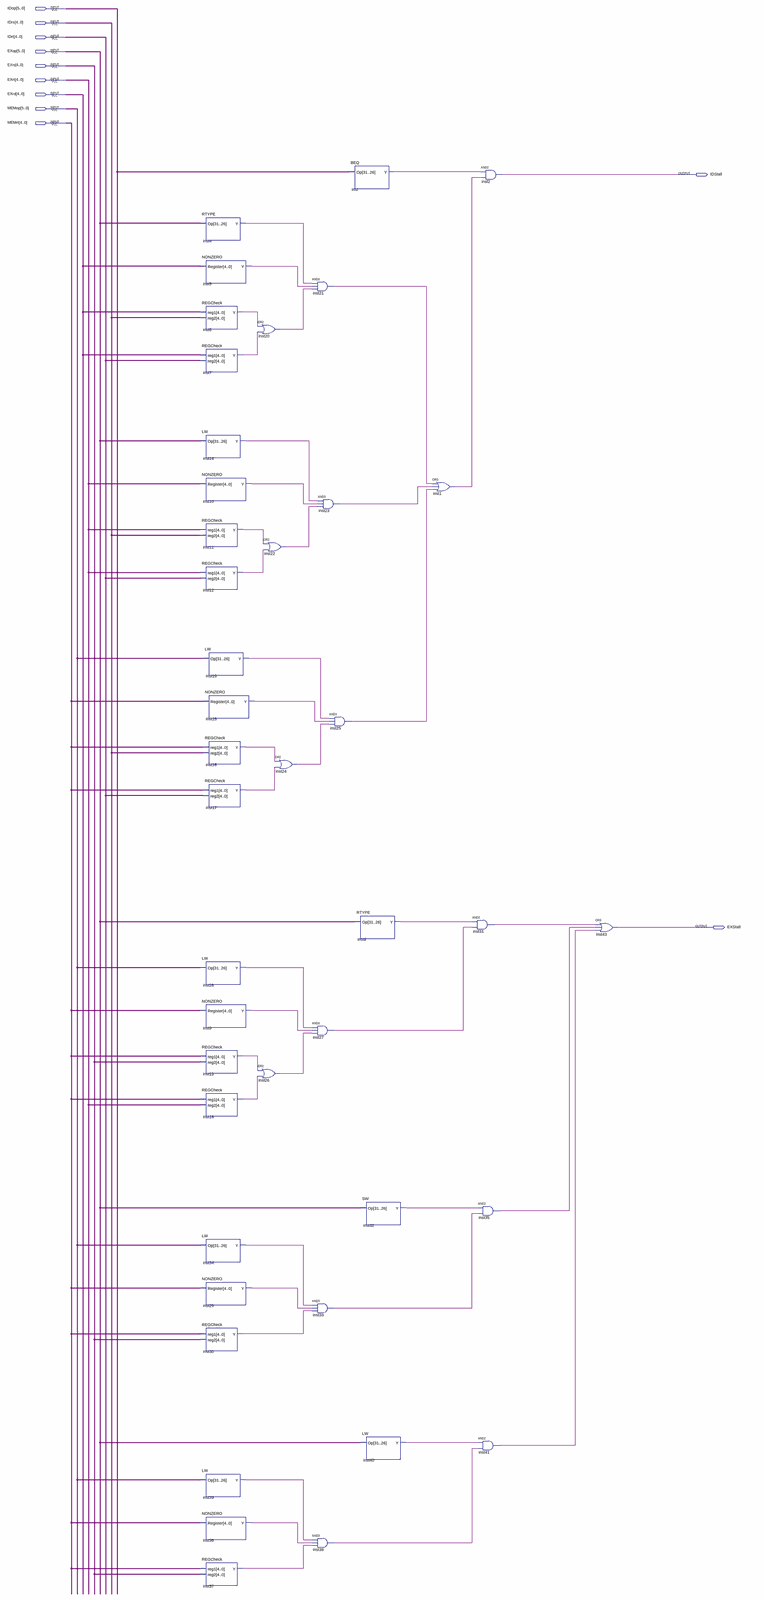
[diagram p0: schematic sheet, whole]
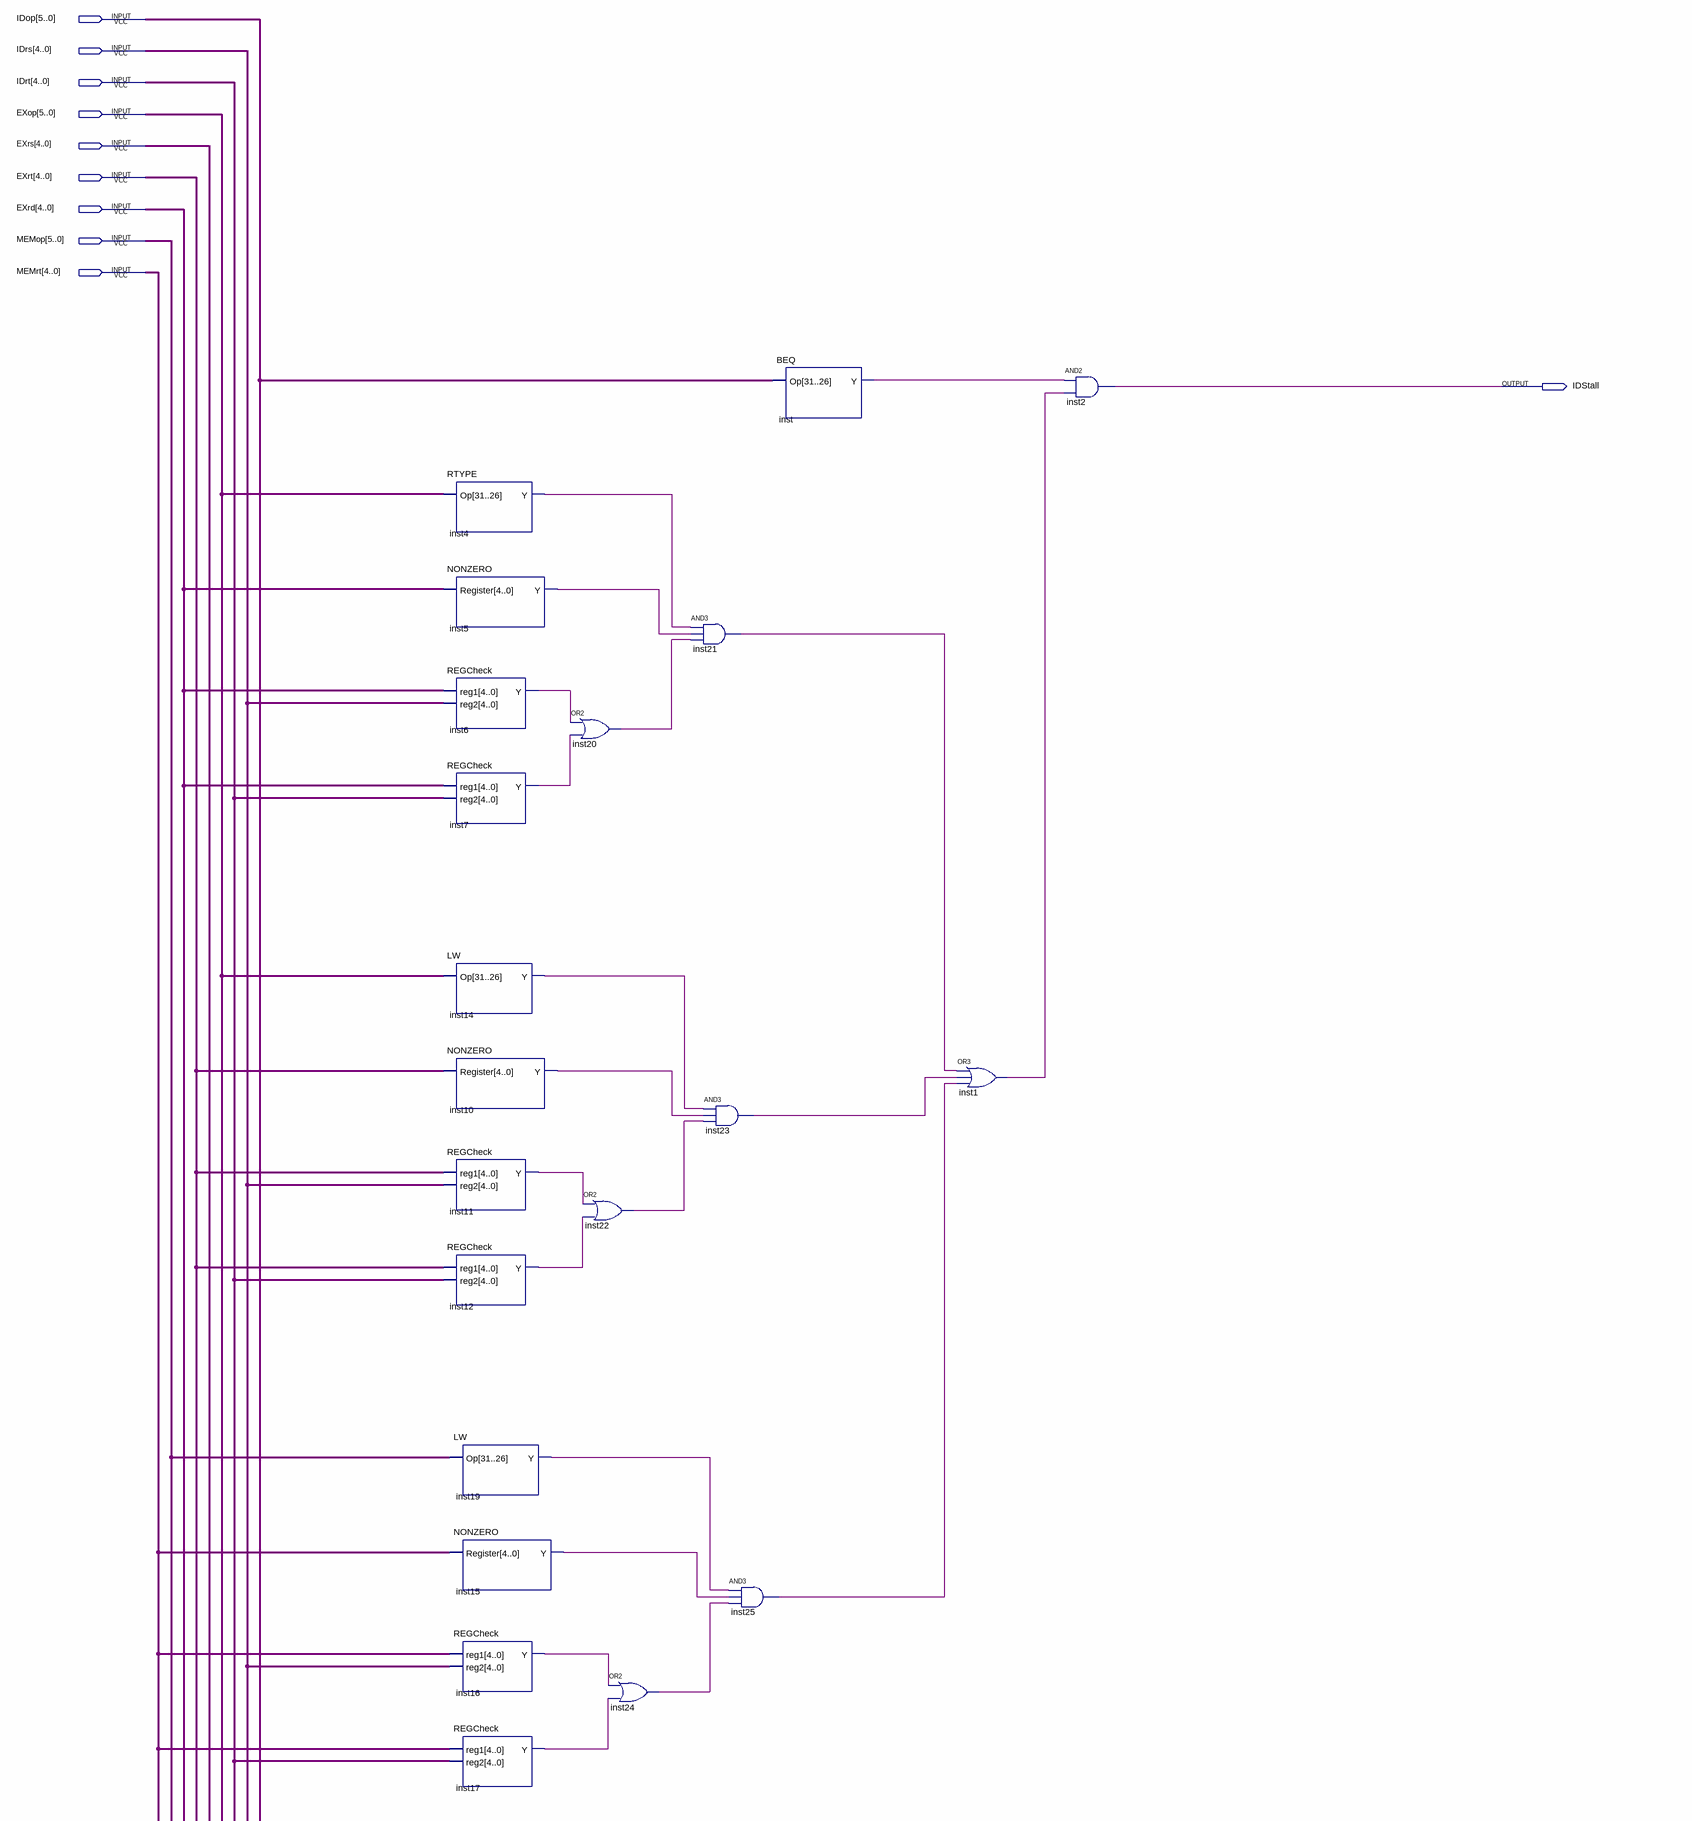
[diagram p1: schematic sheet, upper part]
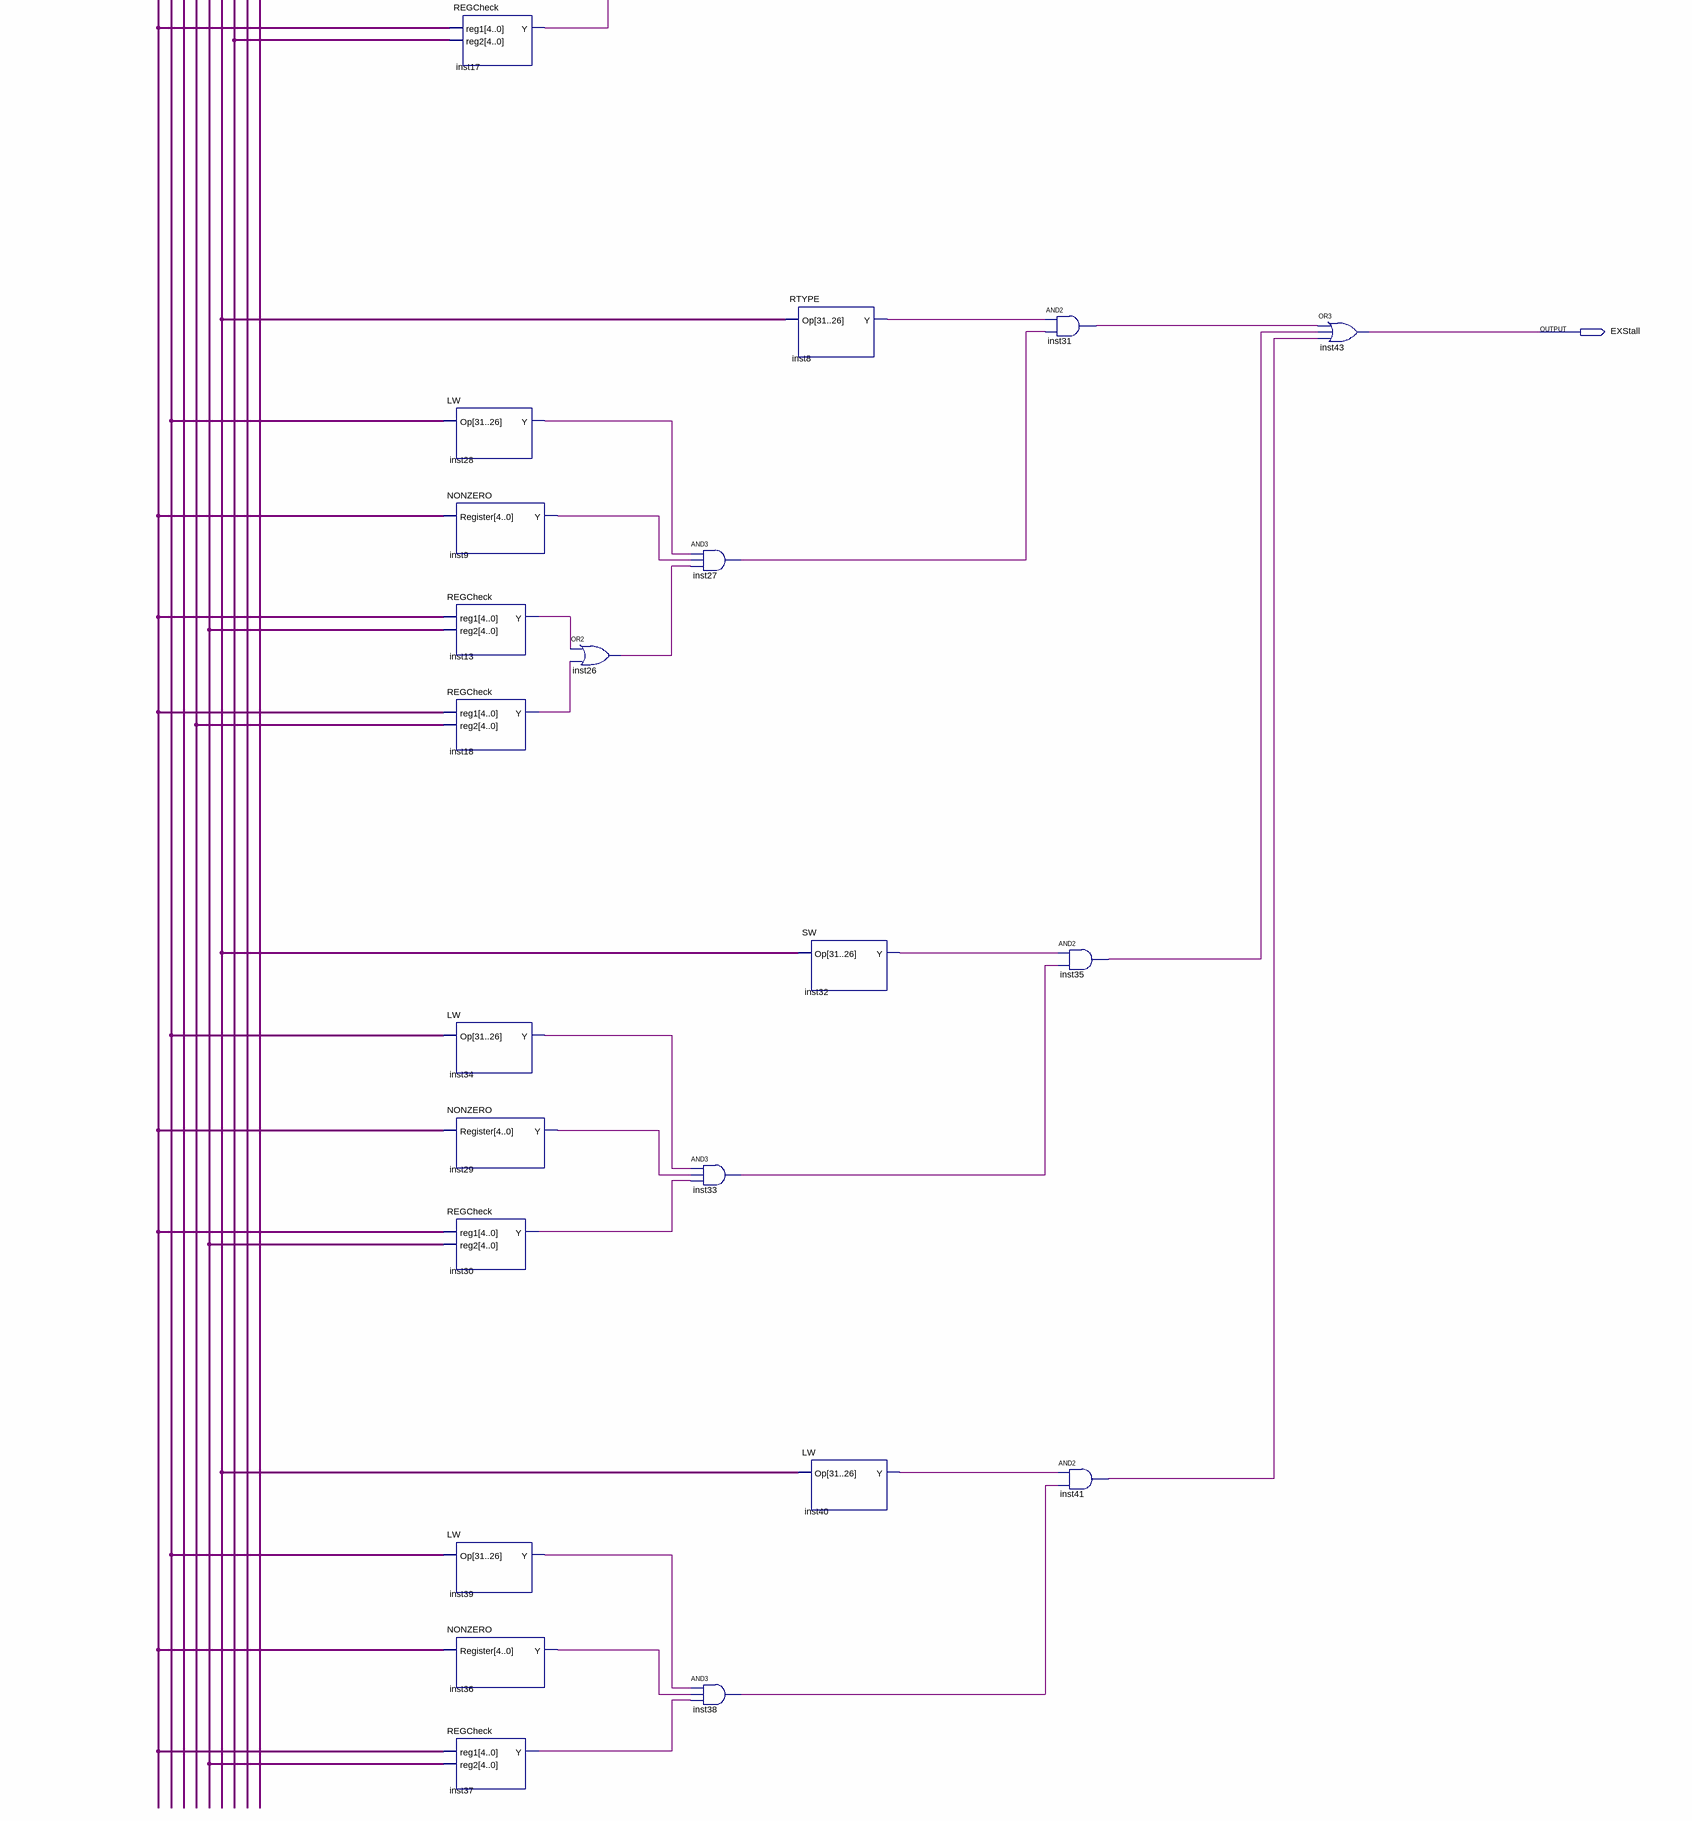
[diagram p2: schematic sheet, lower part]
// Quartus schematic StallDetection.Kevin.bdf as structural Verilog: 42 symbols, 11 pins
module \StallDetection.Kevin  (
  input  [5:0] IDop,
  input  [4:0] IDrs,
  input  [4:0] IDrt,
  input  [5:0] EXop,
  input  [4:0] EXrs,
  input  [4:0] EXrt,
  input  [4:0] EXrd,
  input  [5:0] MEMop,
  input  [4:0] MEMrt,
  output IDStall,
  output EXStall
);

  wire inst1_out, inst4_y, inst5_y, inst6_y, inst7_y, inst8_y, inst9_y, inst10_y, inst11_y, inst12_y,
       inst13_y, inst14_y, inst15_y, inst16_y, inst17_y, inst18_y, inst19_y, inst20_out, inst21_out,
       inst22_out, inst23_out, inst24_out, inst25_out, inst26_out, inst27_out, inst28_y, inst29_y, inst30_y,
       inst31_out, inst32_y, inst33_out, inst34_y, inst35_out, inst36_y, inst37_y, inst38_out, inst39_y,
       inst40_y, inst41_out, inst_y;

  RTYPE inst4 (.Op(EXop), .Y(inst4_y));
  NONZERO inst5 (.Register(EXrd), .Y(inst5_y));
  REGCheck inst6 (.reg1(EXrd), .reg2(IDrs), .Y(inst6_y));
  REGCheck inst7 (.reg1(EXrd), .reg2(IDrt), .Y(inst7_y));
  LW inst14 (.Op(EXop), .Y(inst14_y));
  NONZERO inst10 (.Register(EXrt), .Y(inst10_y));
  REGCheck inst11 (.reg1(EXrt), .reg2(IDrs), .Y(inst11_y));
  REGCheck inst12 (.reg1(EXrt), .reg2(IDrt), .Y(inst12_y));
  LW inst28 (.Op(MEMop), .Y(inst28_y));
  NONZERO inst9 (.Register(MEMrt), .Y(inst9_y));
  REGCheck inst13 (.reg1(MEMrt), .reg2(EXrs), .Y(inst13_y));
  REGCheck inst18 (.reg1(MEMrt), .reg2(EXrt), .Y(inst18_y));
  LW inst34 (.Op(MEMop), .Y(inst34_y));
  NONZERO inst29 (.Register(MEMrt), .Y(inst29_y));
  REGCheck inst30 (.reg1(MEMrt), .reg2(EXrs), .Y(inst30_y));
  LW inst39 (.Op(MEMop), .Y(inst39_y));
  NONZERO inst36 (.Register(MEMrt), .Y(inst36_y));
  REGCheck inst37 (.reg1(MEMrt), .reg2(EXrs), .Y(inst37_y));
  LW inst19 (.Op(MEMop), .Y(inst19_y));
  NONZERO inst15 (.Register(MEMrt), .Y(inst15_y));
  REGCheck inst16 (.reg1(MEMrt), .reg2(IDrs), .Y(inst16_y));
  REGCheck inst17 (.reg1(MEMrt), .reg2(IDrt), .Y(inst17_y));
  or inst20 (inst20_out, inst6_y, inst7_y);
  or inst22 (inst22_out, inst11_y, inst12_y);
  or inst26 (inst26_out, inst13_y, inst18_y);
  or inst24 (inst24_out, inst16_y, inst17_y);
  and inst21 (inst21_out, inst4_y, inst5_y, inst20_out);
  and inst27 (inst27_out, inst28_y, inst9_y, inst26_out);
  and inst33 (inst33_out, inst34_y, inst29_y, inst30_y);
  and inst38 (inst38_out, inst39_y, inst36_y, inst37_y);
  and inst23 (inst23_out, inst14_y, inst10_y, inst22_out);
  and inst25 (inst25_out, inst19_y, inst15_y, inst24_out);
  BEQ inst (.Op(IDop), .Y(inst_y));
  RTYPE inst8 (.Op(EXop), .Y(inst8_y));
  SW inst32 (.Op(EXop), .Y(inst32_y));
  LW inst40 (.Op(EXop), .Y(inst40_y));
  or inst1 (inst1_out, inst21_out, inst23_out, inst25_out);
  and inst31 (inst31_out, inst8_y, inst27_out);
  and inst2 (IDStall, inst_y, inst1_out);
  and inst35 (inst35_out, inst32_y, inst33_out);
  and inst41 (inst41_out, inst40_y, inst38_out);
  or inst43 (EXStall, inst31_out, inst35_out, inst41_out);
endmodule
